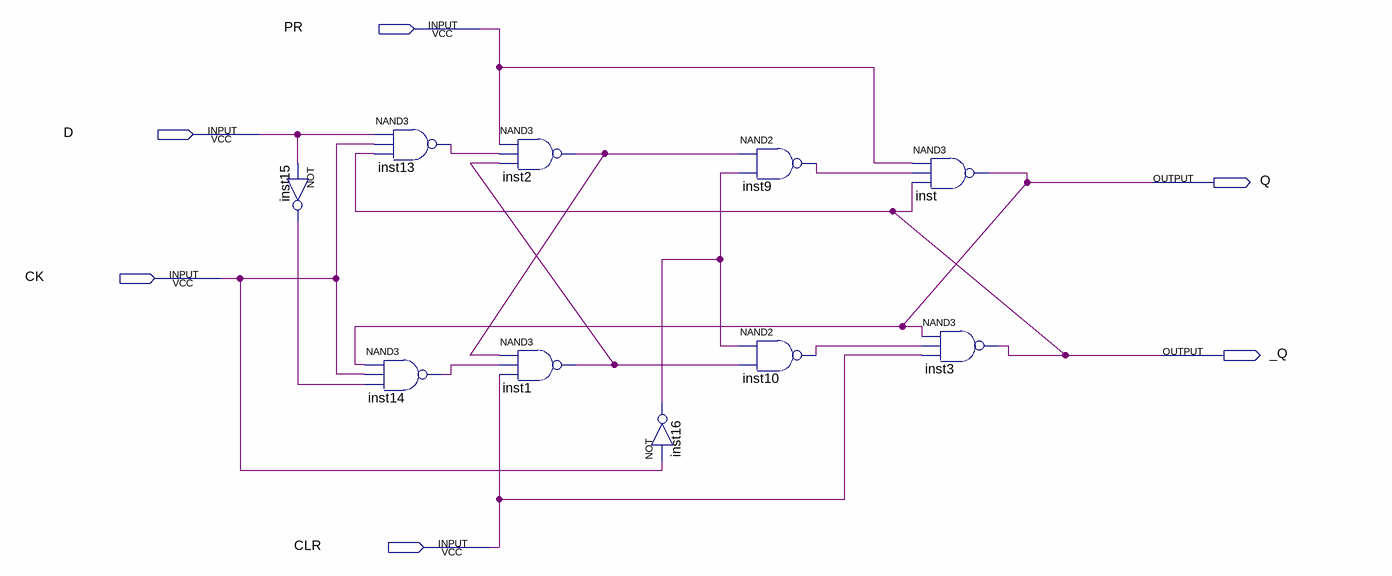
[diagram p0: schematic sheet]
// Quartus schematic ffdclkmsprclr.bdf as structural Verilog: 10 symbols, 6 pins
module ffdclkmsprclr (
  input  PR,
  input  D,
  input  CK,
  input  CLR,
  output Q,
  output _Q
);

  wire inst1_out, inst2_out, inst9_out, inst10_out, inst13_out, inst14_out, inst15_out, inst16_out;

  not inst15 (inst15_out, D);
  nand inst13 (inst13_out, D, CK, _Q);
  nand inst14 (inst14_out, Q, CK, inst15_out);
  nand inst2 (inst2_out, PR, inst13_out, inst1_out);
  nand inst1 (inst1_out, inst2_out, inst14_out, CLR);
  not inst16 (inst16_out, CK);
  nand inst9 (inst9_out, inst2_out, inst16_out);
  nand inst10 (inst10_out, inst16_out, inst1_out);
  nand inst (Q, PR, inst9_out, _Q);
  nand inst3 (_Q, Q, inst10_out, CLR);
endmodule
